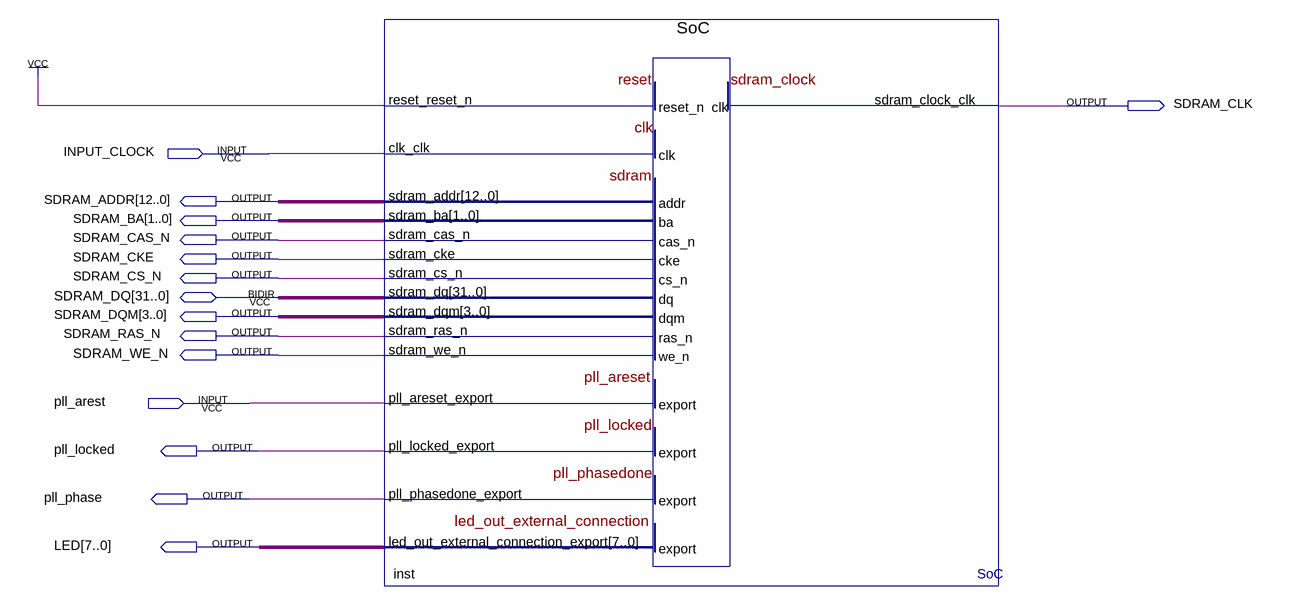
[diagram p0: schematic sheet]
// Quartus schematic TopLevel.bdf as structural Verilog: 1 symbols, 15 pins
module TopLevel (
  input  INPUT_CLOCK,
  input  pll_arest,
  inout  [31:0] SDRAM_DQ,
  output SDRAM_CLK,
  output [12:0] SDRAM_ADDR,
  output [1:0] SDRAM_BA,
  output SDRAM_CAS_N,
  output SDRAM_CKE,
  output SDRAM_CS_N,
  output [3:0] SDRAM_DQM,
  output SDRAM_RAS_N,
  output SDRAM_WE_N,
  output pll_locked,
  output pll_phase,
  output [7:0] LED
);

  SoC inst (
    .reset_reset_n(1'b1), .clk_clk(INPUT_CLOCK), .pll_areset_export(pll_arest), .sdram_clock_clk(SDRAM_CLK),
    .sdram_addr(SDRAM_ADDR), .sdram_ba(SDRAM_BA), .sdram_cas_n(SDRAM_CAS_N), .sdram_cke(SDRAM_CKE),
    .sdram_cs_n(SDRAM_CS_N), .sdram_dqm(SDRAM_DQM), .sdram_ras_n(SDRAM_RAS_N), .sdram_we_n(SDRAM_WE_N),
    .pll_locked_export(pll_locked), .pll_phasedone_export(pll_phase),
    .led_out_external_connection_export(LED), .sdram_dq(SDRAM_DQ));
endmodule
